# EAGLE schematic PowerPCB_90 (EAGLE 7.5.0)
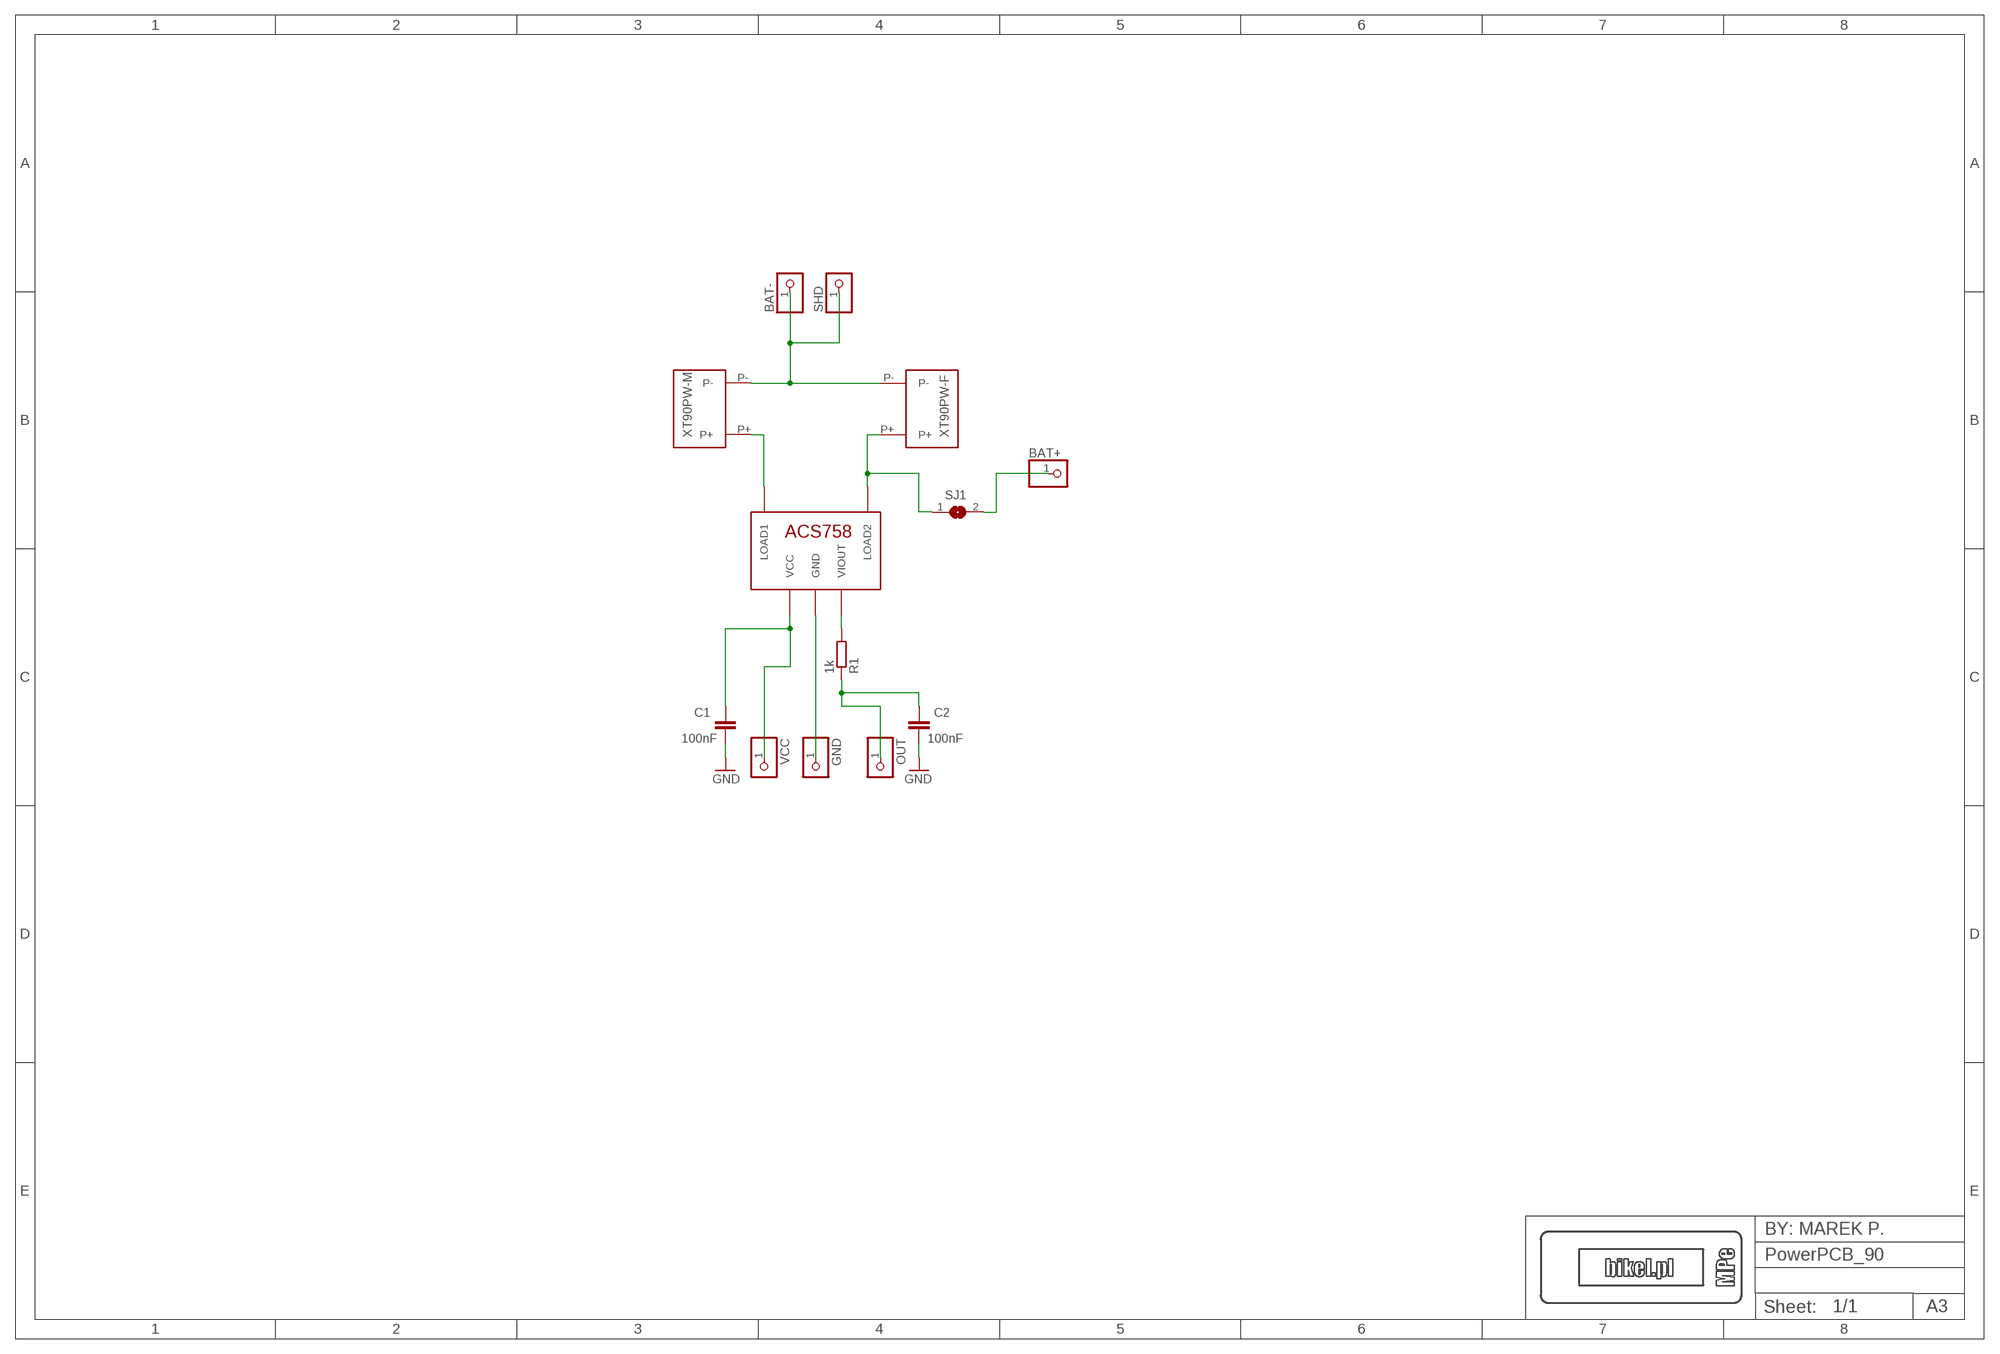
[diagram p0: schematic, sheet 1]

## Parts
ACS758_1  ACS758  [ACS758-PFF]
BAT+  PINHD-1X1  [1X01]
BAT-  PINHD-1X1  [1X01]
C1  100nF  C-EUC0805  [C0805]
C2  100nF  C-EUC0805  [C0805]
GND  PINHD-1X1  [1X01]
OUT  PINHD-1X1  [1X01]
R1  1k  R-EU_R0805  [R0805]
SHD  PINHD-1X1  [1X01]
SJ1  SJ  [SJ]
VCC  PINHD-1X1  [1X01]
XT90PW-F1  XT90PW-F  [XT90PW-F]
XT90PW-M1  XT90PW-M  [XT90PW-M]

## Nets
BAT-: BAT-.1 SHD.1 XT90PW-F1.P- XT90PW-M1.P-
GND: ACS758_1.GND C1.2 C2.2 GND.1
N$1: ACS758_1.VIOUT R1.2
N$2: C2.1 OUT.1 R1.1
N$4: ACS758_1.LOAD1 XT90PW-M1.P+
N$5: ACS758_1.LOAD2 SJ1.1 XT90PW-F1.P+
N$8: ACS758_1.VCC C1.1 VCC.1
N$9: BAT+.1 SJ1.2

## Library data of the parts
ACS758_1 = _marek:ACS758
BAT+ BAT- GND OUT SHD VCC = pinhead:PINHD-1X1: PIN HEADER
C1 C2 = resistor:C-EU: CAPACITOR, European symbol
R1 = resistor:R-EU_: RESISTOR, European symbol
SJ1 = jumper:SJ: SMD solder JUMPER
XT90PW-F1 = _marek:XT90PW-F
XT90PW-M1 = _marek:XT90PW-M